# Altium schematic sheet rad_detector_v500_CONN.SchDoc
size A4; SheetNumber: 5; SheetTotal: 7
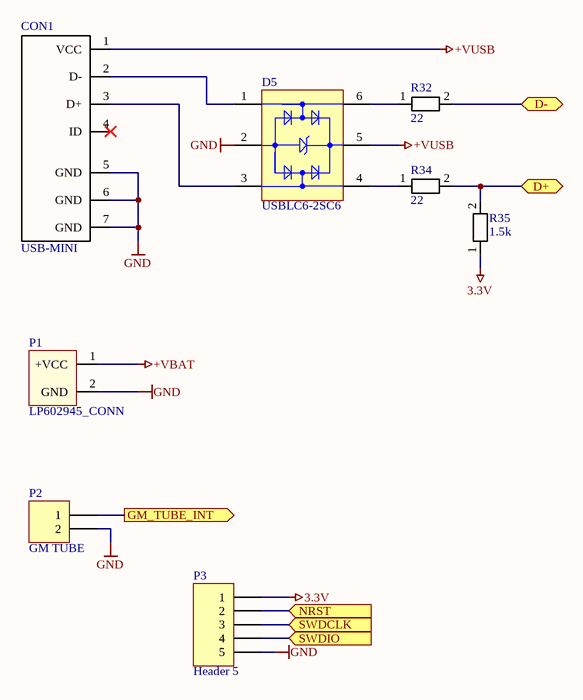
[diagram p0: rad_detector_v500_CONN.SchDoc]

## Parts
CON1  USB-MINI  [USB-MINI]
D5  USBLC6-2SC6  [STM-SOT23-6L_V]
P1  LP602945_CONN  [LP602945_CONN]
P2  GM TUBE  [HDR1X2]
P3  Header 5  [HDR1X5]
R32  22  [0805]
R34  22  [0805]
R35  1.5k  [0805]

## Ports
D+ (bidir, see rad_detector_v500_MAIN[1A]), D- (bidir, see rad_detector_v500_MAIN[1A]), GM_TUBE_INT (out, see rad_detector_v500_MAIN[1A]), NRST (in, see rad_detector_v500_MAIN[1B]), SWDCLK (in, see rad_detector_v500_MAIN[1B], rad_detector_v500_MCU[2C]), SWDIO (in, see rad_detector_v500_MAIN[1B], rad_detector_v500_MCU[2C])

## Nets
3.3V: P3.1 R35.1
+VBAT: P1.1(+VCC)
+VUSB: CON1.1(VCC) D5.5(VBUS)
GND: CON1.5(GND) CON1.6(GND) CON1.7(GND) D5.2(GND) P1.2(GND) P2.2 P3.5
D+: R34.2 R35.2 ; port D+
D-: R32.2 ; port D-
GM_TUBE_INT: P2.1 ; port GM_TUBE_INT
NRST: P3.2 ; port NRST
SWDCLK: P3.3 ; port SWDCLK
SWDIO: P3.4 ; port SWDIO
NetCON1_2: CON1.2(D-) D5.1(I/O_1)
NetCON1_3: CON1.3(D+) D5.3(I/O_2)
NetD5_4: D5.4(I/O_3) R34.1
NetD5_6: D5.6(I/O_4) R32.1

Not connected (* = marked no-connect by the designer): CON1 4(ID)*

## Library data of the parts
D5 = USBLC6-2SC6: Very low capacitance ESD protection, 3.5 pF, -40 to 125 degC, 6-Pin SOT23, RoHS, Tape and Reel; Manufacturer: STMicroelectronics; Polarity: Uni-Directional; Clamping Voltage: 17V; Rad Hardened: No; Product Height (mm): 1.3mm; Leakage Current (Max): 0.15uA; Product Length (mm): 3.05mm; Number of Elements: 1; Peak Pulse Current: 5A; Configuration: Dual; Reverse Breakdown Voltage: 6V; Working Voltage (Max): 5V; Capacitance Value: 3.5pF; Suppressor Type: DiodeArrays; Product Depth (mm): 1.75mm; Test Current (It): 1mA; Package / Case: SOT-23; Operating Temperature Max Deg. C: 125C; Package Description: 6-Pin Small Outline Transistor, Body 2.925 x 1.625 mm, Pitch 0.95 mm; Package Reference: SOT23-6L; Datasheet Version: Rev. 5, 10/2011; Operating Temperature Min Deg. C: -40C; Mounting Style: SurfaceMount; Direction Type: Uni-Directional; Mounting: SurfaceMount; Pin Count: 6; Leakage Current: 0.15uA; Packaging: TapeandReel; Operating Temperature Classification: Automotive; Clamping Voltage (Max): 17V; Manufacturer URL: http://www.st.com/; Reverse Stand-off Voltage: 5V; Datasheet URL: http://www.st.com/st-web-ui/static/active/en/resource/technical/document/datasheet/CD00050750.pdf; Working Voltage: 5V; Operating Temp Range: -40Cto125C
P2 = Header 2: Header, 2-Pin; LatestRevisionDate: 17-Jul-2002; LatestRevisionNote: Re-released for DXP Platform.; Publisher: Altium Limited
P3 = Header 5: Header, 5-Pin; LatestRevisionDate: 17-Jul-2002; LatestRevisionNote: Re-released for DXP Platform.; Publisher: Altium Limited
R32 R34 R35 = RESISTOR: Parameter 1: 10k